# Altium schematic sheet CENTRALLEDS.SchDoc: PROTO QTOUCH (Central LED)
size B; Author: Sébastien Gélinas; Organization: SmartHalo; Address1: 5445 de Gaspé; Address2: Montréal, QC; Address3: Canada; Address4: H2T 3B2; Revision: 1; SheetNumber: 3; SheetTotal: 4
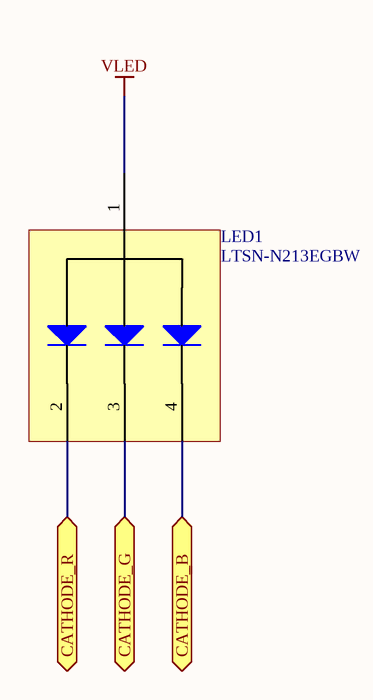
[diagram p0: CENTRALLEDS.SchDoc]

## Parts
LED1  LTSN-N213EGBW  [LTSN-N213EGBW]

## Ports
CATHODE_B, CATHODE_G, CATHODE_R

## Nets
VLED: LED1.1(Anode)
CATHODE_B: LED1.4(Cathode_Blue) ; port CATHODE_B
CATHODE_G: LED1.3(Cathode_Green) ; port CATHODE_G
CATHODE_R: LED1.2(Cathode_Red) ; port CATHODE_R

## Notes on the sheet
- Title
- Size:
- Date:
- B
- Author:
- Time:
- Sheet
- Revision:
- of
- File:

## Library data of the parts
LED1 = LTSN-N213EGBW: LED SMD LTSN-N213EGBW; Manufacturer: LiteOn